# Altium project old_singleboard_now_mcu.PrjPcb (part 4 of 4)

## Sheet misc.SchDoc
size 381 x 241 mm; SheetNumber: 4; SheetTotal: 5
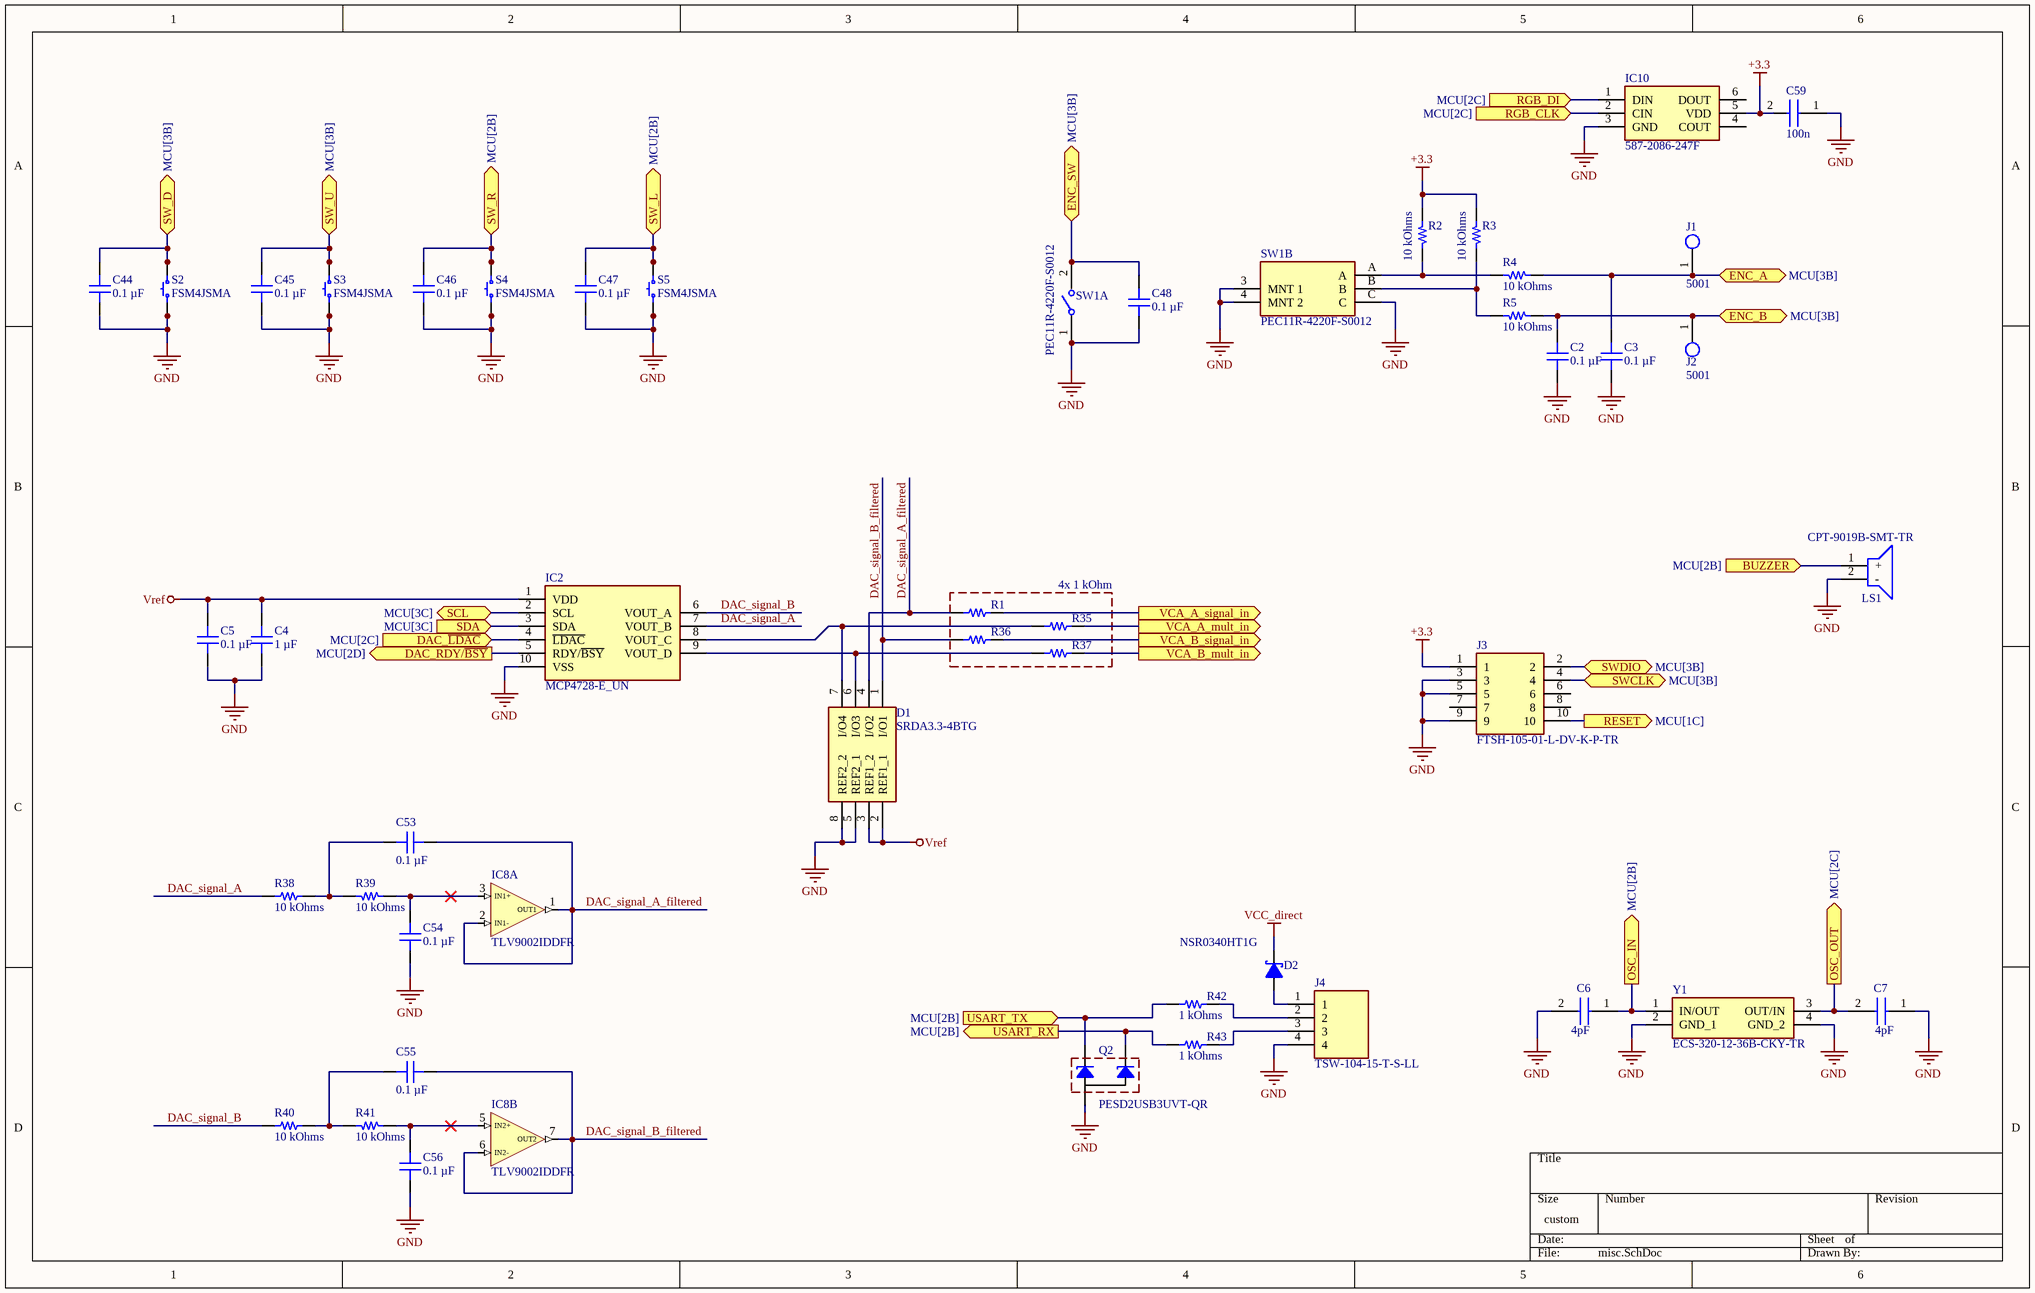
[diagram p8: misc.SchDoc]

### Parts
(Parts that share a designator on the sheet are numbered #1, #2 ... from top to bottom, then left to right.)
C2#2  0.1 µF  [CAP 1206_3216 - 0.8MM]
C3  0.1 µF  [CAP 1206_3216 - 0.8MM]
C4  1 µF  [CAP 1206_3216 - 0.8MM]
C5  0.1 µF  [CAP 1206_3216 - 0.8MM]
C6  4pF  [CAPC1608X80N]
C7#2  4pF  [CAPC1608X80N]
C44  0.1 µF  [CAP 1206_3216 - 0.8MM]
C45  0.1 µF  [CAP 1206_3216 - 0.8MM]
C46#2  0.1 µF  [CAP 1206_3216 - 0.8MM]
C47#2  0.1 µF  [CAP 1206_3216 - 0.8MM]
C48  0.1 µF  [CAP 1206_3216 - 0.8MM]
C53  0.1 µF  [CAP 1206_3216 - 0.8MM]
C54#2  0.1 µF  [CAP 1206_3216 - 0.8MM]
C55  0.1 µF  [CAP 1206_3216 - 0.8MM]
C56  0.1 µF  [CAP 1206_3216 - 0.8MM]
C59  100n  [C0805]
D1#2  SRDA3.3-4BTG  [SOIC8-127P600X175-8N]
D2#2  NSR0340HT1G  [SOD2512X110N]
IC2  MCP4728-E_UN  [SOP50P490X110-10N]
IC8  TLV9002IDDFR  [SOT65P280X110-8N]  (parts A,B of 3)
IC10  587-2086-247F  [5872086247F]
J1#1  5001  [FP-5001-MFG]
J2#1  5001  [FP-5001-MFG]
J3#2  FTSH-105-01-L-DV-K-P-TR  [FTSH-105-XX-YYY-DV-K-P-TR]
J4#2  TSW-104-15-T-S-LL  [HDRV4W64P254_1X4_1016X241X1575P]
LS1  CPT-9019B-SMT-TR  [CPT9019BSMTTR]
Q2#2  PESD2USB3UVT-QR  [SOT95P230X110-3N]
R1#2  1 kOhms  [YAGEO RES 1206_3216]  (value not drawn)
R2#2  10 kOhms  [YAGEO RES 1206_3216]
R3#2  10 kOhms  [YAGEO RES 1206_3216]
R4#2  10 kOhms  [YAGEO RES 1206_3216]
R5#2  10 kOhms  [YAGEO RES 1206_3216]
R35#2  1 kOhms  [YAGEO RES 1206_3216]  (value not drawn)
R36#2  1 kOhms  [YAGEO RES 1206_3216]  (value not drawn)
R37#2  1 kOhms  [YAGEO RES 1206_3216]  (value not drawn)
R38#2  10 kOhms  [RES 1206_3216]
R39#2  10 kOhms  [YAGEO RES 1206_3216]
R40#2  10 kOhms  [RES 1206_3216]
R41#2  10 kOhms  [YAGEO RES 1206_3216]
R42#2  1 kOhms  [YAGEO RES 1206_3216]
R43#2  1 kOhms  [YAGEO RES 1206_3216]
S2  FSM4JSMA  [TE FSM4JSMA]
S3  FSM4JSMA  [TE FSM4JSMA]
S4  FSM4JSMA  [TE FSM4JSMA]
S5  FSM4JSMA  [TE FSM4JSMA]
SW1  PEC11R-4220F-S0012  [FP-PEC11R-4220F-S0012-MFG]  (parts A,B of 2)
Y1  ECS-320-12-36B-CKY-TR  [ECS240836QAESTR]

### Blocks framed on the sheet
4x 1 kOhm: R1#2 R35#2 R36#2 R37#2

### Ports
BUZZER (in, see MCU[2B]), DAC_RDY/~{BSY} (out, see MCU[2D]), DAC_~{LDAC} (in, see MCU[2C]), ENC_A (bidir, see MCU[3B]), ENC_B (bidir, see MCU[3B]), ENC_SW (bidir, see MCU[3B]), OSC_IN (out, see MCU[2B]), OSC_OUT (out, see MCU[2C]), RESET (out, see MCU[1C]), RGB_CLK (in, see MCU[2C]), RGB_DI (in, see MCU[2C]), SCL (bidir, see MCU[3C]), SDA (in, see MCU[3C]), SW_D (bidir, see MCU[3B]), SW_L (bidir, see MCU[2B]), SW_R (bidir, see MCU[2B]), SW_U (bidir, see MCU[3B]), SWCLK (bidir, see MCU[3B]), SWDIO (bidir, see MCU[3B]), USART_RX (out, see MCU[2B]), USART_TX (in, see MCU[2B]), VCA_A_mult_in (out), VCA_A_signal_in (out), VCA_B_mult_in (out), VCA_B_signal_in (out)

### Nets
+3.3: C59.2 IC10.5(VDD) J3#2.1 R2#2.1 R3#2.1
GND: C2#2.1 C3.1 C4.1 C5.1 C6.2 C7#2.1 C44.1 C45.1 C46#2.1 C47#2.1 C48.1 C54#2.2 C56.2 C59.1 D1#2.5(REF2_1) D1#2.8(REF2_2) IC2.10(VSS) IC10.3(GND) J3#2.3 J3#2.5 J3#2.9 J4#2.4 LS1.2(-) Q2#2.3(CA) S2.1 S2.2 S3.1 S3.2 S4.1 S4.2 S5.1 S5.2 SW1.1 SW1.3(MNT_1) SW1.4(MNT_2) SW1.C Y1.2(GND_1) Y1.4(GND_2)
VCC_direct: D2#2.1(C)
Vref: C4.2 C5.2 D1#2.2(REF1_1) D1#2.3(REF1_2) IC2.1(VDD)
DAC_signal_A: IC2.7(VOUT_B) R38#2.1
DAC_signal_A_filtered: C53.1 D1#2.4(I/O2) IC8.1(OUT1) IC8.2(IN1-) R1#2.2
DAC_signal_B: IC2.6(VOUT_A) R40#2.1
DAC_signal_B_filtered: C55.1 D1#2.1(I/O1) IC8.6(IN2-) IC8.7(OUT2) R36#2.2
NetC1#2_2: J3#2.10 ; port RESET
NetC2#2_2: C2#2.2 J2#1.1 R5#2.2 ; port ENC_B
NetC3_2: C3.2 J1#1.1 R4#2.2 ; port ENC_A
NetC6_1: C6.1 Y1.1(IN/OUT) ; port OSC_IN
NetC7#2_2: C7#2.2 Y1.3(OUT/IN) ; port OSC_OUT
NetC44_2: C44.2 S2.3 S2.4 ; port SW_D
NetC45_2: C45.2 S3.3 S3.4 ; port SW_U
NetC46#2_2: C46#2.2 S4.3 S4.4 ; port SW_R
NetC47#2_2: C47#2.2 S5.3 S5.4 ; port SW_L
NetC48_2: C48.2 SW1.2 ; port ENC_SW
NetC53_2: C53.2 R38#2.2 R39#2.2
NetC54#2_1: C54#2.1 IC8.3(IN1+) R39#2.1
NetC55_2: C55.2 R40#2.2 R41#2.2
NetC56_1: C56.1 IC8.5(IN2+) R41#2.1
NetD1#2_6: D1#2.6(I/O3) IC2.9(VOUT_D) R37#2.2
NetD1#2_7: D1#2.7(I/O4) IC2.8(VOUT_C) R35#2.2
NetD2#2_2: D2#2.2(A) J4#2.1
NetIC1_1: LS1.1(+) ; port BUZZER
NetIC1_11: IC10.1(DIN) ; port RGB_DI
NetIC1_12: IC10.2(CIN) ; port RGB_CLK
NetIC1_13: IC2.4(~{LDAC}) ; port DAC_~{LDAC}
NetIC1_14: IC2.5(RDY/~{BSY}) ; port DAC_RDY/~{BSY}
NetIC1_25: IC2.2(SCL) ; port SCL
NetIC1_26: IC2.3(SDA) ; port SDA
NetIC1_35: J3#2.2 ; port SWDIO
NetIC1_36: J3#2.4 ; port SWCLK
NetIC1_45: Q2#2.1(K1) R42#2.2 ; port USART_TX
NetIC1_46: Q2#2.2(K2) R43#2.2 ; port USART_RX
NetJ4#2_2: J4#2.2 R42#2.1
NetJ4#2_3: J4#2.3 R43#2.1
NetR1#2_1: R1#2.1 ; port VCA_A_signal_in
NetR2#2_2: R2#2.2 R4#2.1 SW1.A
NetR3#2_2: R3#2.2 R5#2.1 SW1.B
NetR27#1_1: R35#2.1 ; port VCA_A_mult_in
NetR36#2_1: R36#2.1 ; port VCA_B_signal_in
NetR37#2_1: R37#2.1 ; port VCA_B_mult_in

Not connected (* = marked no-connect by the designer): IC10 4(COUT) 6(DOUT); J3#2 6 7 8

### Library data of the parts
C2#2 C3 C5 C44 C45 C46#2 C47#2 C48 C53 C54#2 C55 C56 = 885012208087: CAP CER 0.1UF 50V X7R 1206; manufacturer: Würth Elektronik; Tolerance: ±10%; Part Number: 885012208087; Capacitance: 0.1 µF; Applications: General Purpose; componentlink1description: Datasheet; componentlink1url: https://katalog.we-online.de/pbs/datasheet/885012208087.pdf; componentlink2description: DigiKey Link; componentlink2url: https://www.digikey.com/en/products/detail/würth-elektronik/885012208087/5453982; Device Package: 1206 (3216 Metric); lastupdated: 6/4/2024 19:10:27; Lifecycle Status: Active; Minimum Order: 1; Mounting Type: Surface Mount, MLCC; Operating Temperature: -55°C ~ 125°C; Package / Case: 1206 (3216 Metric); packaging: TapeAndReel; partid: 20879; Part Status: Active; price: 0.06; series: WCAP-CSGP; Size / Dimension: 0.126" L x 0.063" W (3.20mm x 1.60mm); Supplier 1: DigiKey; Supplier Part Number 1: 732-8127-1-ND; Temperature Coefficient: X7R; Thickness (Max): 0.035" (0.90mm); value: 0.1 µF; Voltage - Rated: 50V
C4 = 885012208093: as C7#1 on sheet vca_A; Part Number: 885012208093; Capacitance: 1 µF; Applications: General Purpose; componentlink1description: Datasheet; componentlink1url: https://katalog.we-online.de/pbs/datasheet/885012208093.pdf; componentlink2description: DigiKey Link; componentlink2url: https://www.digikey.com/en/products/detail/würth-elektronik/885012208093/5453432; Device Package: 1206 (3216 Metric); lastupdated: 6/4/2024 19:10:33; Lifecycle Status: Active; Minimum Order: 1; Mounting Type: Surface Mount, MLCC; Operating Temperature: -55°C ~ 125°C; Package / Case: 1206 (3216 Metric); packaging: TapeAndReel; partid: 39665; Part Status: Active; price: 0.10; series: WCAP-CSGP; Size / Dimension: 0.126" L x 0.063" W (3.20mm x 1.60mm); Supplier 1: DigiKey; Supplier Part Number 1: 732-7577-1-ND; Temperature Coefficient: X7R; Thickness (Max): 0.075" (1.90mm); value: 1 µF; Voltage - Rated: 50V
C6 C7#2 = C1608C0G1H040C080AA: Capacitor; Manufacturer_Name: TDK; Datasheet Link: https://product.tdk.com/info/en/catalog/datasheets/mlcc_commercial_midvoltage_en.pdf; Height: 0.8mm; Manufacturer_Part_Number: C1608C0G1H040C080AA; Arrow Part Number: C1608C0G1H040C080AA; Arrow Price/Stock: https://www.arrow.com/en/products/c1608c0g1h040c080aa/tdk
C59 = C0805C104K3RACTU: Capacitor; Manufacturer_Name: KEMET; Datasheet Link: https://content.kemet.com/datasheets/KEM_C1002_X7R_SMD.pdf; Height: 1.1mm; Manufacturer_Part_Number: C0805C104K3RACTU; Mouser Part Number: 80-C0805C104K3R; Mouser Price/Stock: https://www.mouser.co.uk/ProductDetail/KEMET/C0805C104K3RACTU?qs=zZwvocWqSRjmUvfNxkIN%2Fg%3D%3D; Arrow Part Number: C0805C104K3RACTU; Arrow Price/Stock: https://www.arrow.com/en/products/c0805c104k3ractu/kemet-corporation
D1#2 = SRDA3.3-4BTG: TVS Diode (Bi-directional); Manufacturer_Name: LITTELFUSE; Datasheet Link: https://www.littelfuse.com/~/media/electronics/datasheets/tvs_diode_arrays/littelfuse_tvs_diode_array_srda3_3_datasheet.pdf.pdf; Height: 1.75mm; Manufacturer_Part_Number: SRDA3.3-4BTG; Mouser Part Number: 576-SRDA3.3-4BTG; Mouser Price/Stock: https://www.mouser.co.uk/ProductDetail/Littelfuse/SRDA3.3-4BTG?qs=wqPJ3MBjhrh9DaqZL3Nnvw%3D%3D; Arrow Part Number: SRDA3.3-4BTG; Arrow Price/Stock: https://www.arrow.com/en/products/srda3.3-4btg/littelfuse?utm_currency=USD&region=nac
D2#2 = NSR0340HT1G: Diode; Manufacturer_Name: onsemi; Datasheet Link: https://www.onsemi.com/pub/Collateral/NSR0340H-D.PDF; Height: 1.1mm; Manufacturer_Part_Number: NSR0340HT1G; Mouser Part Number: 863-NSR0340HT1G; Mouser Price/Stock: https://www.mouser.co.uk/ProductDetail/onsemi/NSR0340HT1G?qs=agb4oTp1Mj%2FMC6G4Sgc%2FTQ%3D%3D; Arrow Part Number: NSR0340HT1G; Arrow Price/Stock: https://www.arrow.com/en/products/nsr0340ht1g/on-semiconductor?utm_currency=USD&region=nac
IC2 = MCP4728-E_UN: Integrated Circuit; Manufacturer_Name: Microchip; Manufacturer_Part_Number: MCP4728-E/UN; Datasheet Link: http://ww1.microchip.com/downloads/en/DeviceDoc/22187E.pdf; Height: 1.1mm; Mouser Part Number: 579-MCP4728-E/UN; Mouser Price/Stock: https://www.mouser.co.uk/ProductDetail/Microchip-Technology/MCP4728-E-UN?qs=E6wAi2XWqcP2zTenScklGA%3D%3D; Arrow Part Number: MCP4728-E/UN; Arrow Price/Stock: https://www.arrow.com/en/products/mcp4728-eun/microchip-technology?utm_currency=USD&region=nac
IC8 = TLV9002IDDFR: as IC3 on sheet filters; Datasheet Link: https://www.ti.com/lit/gpn/TLV9002; Height: 1.1mm; Manufacturer_Part_Number: TLV9002IDDFR; Mouser Part Number: 595-TLV9002IDDFR; Mouser Price/Stock: https://www.mouser.co.uk/ProductDetail/Texas-Instruments/TLV9002IDDFR?qs=mAH9sUMRCtuVJ6NmNV%252Bgrw%3D%3D; Arrow Part Number: TLV9002IDDFR; Arrow Price/Stock: https://www.arrow.com/en/products/tlv9002iddfr/texas-instruments?utm_currency=USD&region=nac
IC10 = 587-2086-247F: Integrated Circuit; Manufacturer_Name: Dialight; Datasheet Link: https://s3-us-west-2.amazonaws.com/catsy.557/Dialight_datasheet_587-2086-247F_Addressable_RGB.pdf; Height: 1mm; Manufacturer_Part_Number: 587-2086-247F; Mouser Part Number: 645-587-2086-247F; Mouser Price/Stock: https://www.mouser.co.uk/ProductDetail/Dialight/587-2086-247F?qs=iLKYxzqNS76TDIp9wEi56Q%3D%3D
J1#1 J2#1 = CMP-2000-05181-2: PC TEST POINT MINIATURE BLACK; Body Material: Bronze; Plating: Silver; Inside Diameter: 1.27mm; Hole Diameter: 1.6mm; Number of Ports: 1; Outside Diameter: 2.54mm; Insulation: Insulated; Insulation Material: Nylon; Mount: Through Hole; RoHS Compliant: Yes; Series: THM; Height: 0.3inch; Termination: Through Hole; Material: Nylon; Packaging: Bulk; Contact Material: Bronze; REACH SVHC: No SVHC; Contact Plating: Silver; Orientation: Straight; Lead Free: Lead Free; Package Quantity: 100; Length: 7.62mm; Flammability Rating: UL94 V-0; Number of Contacts: 1; Diameter: 2.54mm; Housing Color: Black; Color: Black
J3#2 = FTSH-105-01-L-DV-K-P-TR: Connector; Manufacturer_Name: SAMTEC; Datasheet Link: http://suddendocs.samtec.com/prints/ftsh-1xx-xx-xxx-dv-xxx-xxx-mkt.pdf; Manufacturer_Part_Number: FTSH-105-01-L-DV-K-P-TR; Mouser Part Number: 200-FTSH10501LDVKPTR; Mouser Price/Stock: https://www.mouser.co.uk/ProductDetail/Samtec/FTSH-105-01-L-DV-K-P-TR?qs=fnpEE5GccuMUjCRgxv4voQ%3D%3D; Arrow Part Number: FTSH-105-01-L-DV-K-P-TR; Arrow Price/Stock: https://www.arrow.com/en/products/ftsh-105-01-l-dv-k-p-tr/samtec?utm_currency=USD&region=europe
J4#2 = TSW-104-15-T-S-LL: Connector; Manufacturer_Name: SAMTEC; Datasheet Link: http://suddendocs.samtec.com/catalog_english/tsw_th.pdf; Height: 15.75mm; Manufacturer_Part_Number: TSW-104-15-T-S-LL; Mouser Part Number: 200-TSW10415TSLL; Mouser Price/Stock: https://www.mouser.co.uk/ProductDetail/Samtec/TSW-104-15-T-S-LL?qs=rU5fayqh%252BE1Oq%252BEC9ZwiVQ%3D%3D
LS1 = CPT-9019B-SMT-TR: Loudspeaker or Buzzer; Manufacturer_Name: Same Sky; Datasheet Link: https://www.sameskydevices.com/product/resource/supplyframepdf/cpt-9019b-smt-tr.pdf; Height: 2.1mm; Manufacturer_Part_Number: CPT-9019B-SMT-TR; Mouser Part Number: 179-CPT-9019B-SMT-TR; Mouser Price/Stock: https://www.mouser.co.uk/ProductDetail/CUI-Devices/CPT-9019B-SMT-TR?qs=3Rah4i%252BhyCGQOzp5C27TLw%3D%3D
Q2#2 = PESD2USB3UVT-QR: Transistor; Manufacturer_Name: Nexperia; Datasheet Link: https://assets.nexperia.com/documents/data-sheet/PESD2USB3UVT-Q.pdf; Height: 1.1mm; Manufacturer_Part_Number: PESD2USB3UVT-QR; Mouser Part Number: 771-PESD2USB3UVT-QR; Mouser Price/Stock: https://www.mouser.co.uk/ProductDetail/Nexperia/PESD2USB3UVT-QR?qs=3Rah4i%252BhyCFPJOQFghMZ%252BQ%3D%3D; Arrow Part Number: PESD2USB3UVT-QR; Arrow Price/Stock: https://www.arrow.com/en/products/pesd2usb3uvt-qr/nexperia?utm_currency=USD&region=europe
R1#2 R35#2 R36#2 R37#2 R42#2 R43#2 = RT1206FRE071KL: RES SMD 1K OHM 1% 1/4W 1206; Manufacturer: Yageo; Power (Watts): 0.25W, 1/4W; Temperature Coefficient: ±50ppm/°C; Part Number: RT1206FRE071KL; ComponentLink1Description: Datasheet; ComponentLink1URL: https://www.yageo.com/upload/media/product/productsearch/datasheet/rchip/PYu-RT_1-to-0.01_RoHS_L_11.pdf; ComponentLink2Description: DigiKey Link; ComponentLink2URL: https://www.digikey.com/en/products/detail/yageo/RT1206FRE071KL/1083016; Composition: Thin Film; Device Package: 1206 (3216 Metric); Height - Seated (Max): 0.026" (0.65mm); LastUpdated: 7/25/2024 09:21:27; Lifecycle Status: Active; Minimum Order: 1; Number of Terminations: 2; Operating Temperature: -55°C ~ 155°C; Package / Case: 1206 (3216 Metric); Packaging: TapeAndReel; PartId: 40465; Part Status: Active; Price: 0.01; Resistance: 1 kOhms; Series: RT; Size / Dimension: 0.122" L x 0.063" W (3.10mm x 1.60mm); Supplier 1: DigiKey; Supplier Part Number 1: YAG3366CT-ND; Supplier Device Package: 1206; Tolerance: ±1%; Value: 1 kOhms
R2#2 R3#2 R4#2 R5#2 R39#2 R41#2 = RT1206FRE0710KL: as R60 on sheet source_A; Part Number: RT1206FRE0710KL; ComponentLink1Description: Datasheet; ComponentLink1URL: https://www.yageo.com/upload/media/product/productsearch/datasheet/rchip/PYu-RT_1-to-0.01_RoHS_L_11.pdf; ComponentLink2Description: DigiKey Link; ComponentLink2URL: https://www.digikey.com/en/products/detail/yageo/RT1206FRE0710KL/1082868; Composition: Thin Film; Device Package: 1206 (3216 Metric); Height - Seated (Max): 0.026" (0.65mm); LastUpdated: 7/25/2024 09:21:28; Lifecycle Status: Active; Minimum Order: 1; Number of Terminations: 2; Operating Temperature: -55°C ~ 155°C; Package / Case: 1206 (3216 Metric); Packaging: TapeAndReel; PartId: 38903; Part Status: Active; Price: 0.01; Resistance: 10 kOhms; Series: RT; Size / Dimension: 0.122" L x 0.063" W (3.10mm x 1.60mm); Supplier 1: DigiKey; Supplier Part Number 1: YAG1242CT-ND; Supplier Device Package: 1206; Tolerance: ±1%; Value: 10 kOhms
R38#2 R40#2 = ERA-8AEB103V: RES SMD 10K OHM 0.1% 1/4W 1206; Manufacturer: Panasonic Electronic Components; Power (Watts): 0.25W, 1/4W; Temperature Coefficient: ±25ppm/°C; Part Number: ERA-8AEB103V; ComponentLink1Description: Datasheet; ComponentLink1URL: https://industrial.panasonic.com/cdbs/www-data/pdf/RDM0000/AOA0000C307.pdf; ComponentLink2Description: DigiKey Link; ComponentLink2URL: https://www.digikey.com/en/products/detail/panasonic-electronic-components/ERA-8AEB103V/3070742; Composition: Thin Film; Device Package: 1206 (3216 Metric); Features: Automotive AEC-Q200; Height - Seated (Max): 0.028" (0.70mm); LastUpdated: 2/9/2024 20:54:17; Lifecycle Status: Active; Minimum Order: 1; Number of Terminations: 2; Operating Temperature: -55°C ~ 155°C; Package / Case: 1206 (3216 Metric); Packaging: TapeAndReel; PartId: 33990; Part Status: Active; Price: 0.10; Ratings: AEC-Q200; Resistance: 10 kOhms; Series: ERA-8A; Size / Dimension: 0.126" L x 0.063" W (3.20mm x 1.60mm); Supplier 1: DigiKey; Supplier Part Number 1: P10KBCCT-ND; Supplier Device Package: 1206; Tolerance: ±0.1%; Value: 10 kOhms
S2-S5 = FSM4JSMA: SWITCH TACTILE SPST-NO 0.05A 24V; Manufacturer: TE Connectivity ALCOSWITCH Switches; Actuator Height off PCB, Vertical: 5.00mm; Actuator Orientation: Top Actuated; Actuator Type: Standard; Contact Rating @ Voltage: 0.05A @ 24VDC; Illumination: Non-Illuminated; Operating Force: 160gf; Outline: 6.00mm x 6.00mm; Switch Function: Off-Mom; Part Number: FSM4JSMA; Circuit: SPST-NO; ComponentLink1Description: Datasheet; ComponentLink1URL: https://www.te.com/commerce/DocumentDelivery/DDEController?Action=srchrtrv&DocNm=1308111-1_SWITCHES_CORE_PROGRAM_CATALOG&DocType=CS&DocLang=English; ComponentLink2Description: DigiKey Link; ComponentLink2URL: https://www.digikey.com/en/products/detail/te-connectivity-alcoswitch-switches/FSM4JSMA/525821; LastUpdated: 6/3/2024 20:19:31; Lifecycle Status: Active; Minimum Order: 1; Mounting Type: Surface Mount; Operating Temperature: -35°C ~ 85°C; Packaging: Bulk; Part Status: Active; Price: 0.14; Series: FSMJSMA; Supplier 1: DigiKey; Supplier Part Number 1: 450-1129-ND; Termination Style: Gull Wing
SW1 = PEC11R-4220F-S0012: ROTARY ENCODER MECHANICAL 12PPR; Built in Switch: Yes; Number of Channels: 2; Output Type: Quadrature; Hole Diameter: 7mm; Pulses per Revolution: 12; Termination: PC Pin; Package Quantity: 150; RoHS Compliant: Yes; Mount: Through Hole; Width: 12.5mm; Radiation Hardening: No; Number of Pins: 5; REACH SVHC: No SVHC; Type: Mechanical; Packaging: Bulk; Min Operating Temperature: -30°C; Encoder Type: Mechanical; Height: 13.4mm; Length: 26.5mm; Orientation: Vertical; Max Operating Temperature: 70°C; Series: PEC11R; Detent: Yes
Y1 = ECS-320-12-36B-CKY-TR: Crystal or Oscillator; Manufacturer_Name: ECS; Datasheet Link: https://www.ecsxtal.com/store/pdf/ECX-2236B.pdf; Height: 0mm; Manufacturer_Part_Number: ECS-320-12-36B-CKY-TR; Mouser Part Number: 520-320-12-36B-CKYT; Mouser Price/Stock: https://www.mouser.co.uk/ProductDetail/ECS/ECS-320-12-36B-CKY-TR?qs=l7cgNqFNU1juKISosFzRbg%3D%3D; Arrow Part Number: ECS-320-12-36B-CKY-TR; Arrow Price/Stock: https://www.arrow.com/en/products/ecs-320-12-36b-cky-tr/ecs-international

## Sheet connectors.SchDoc
size 381 x 241 mm; SheetNumber: 10; SheetTotal: 12
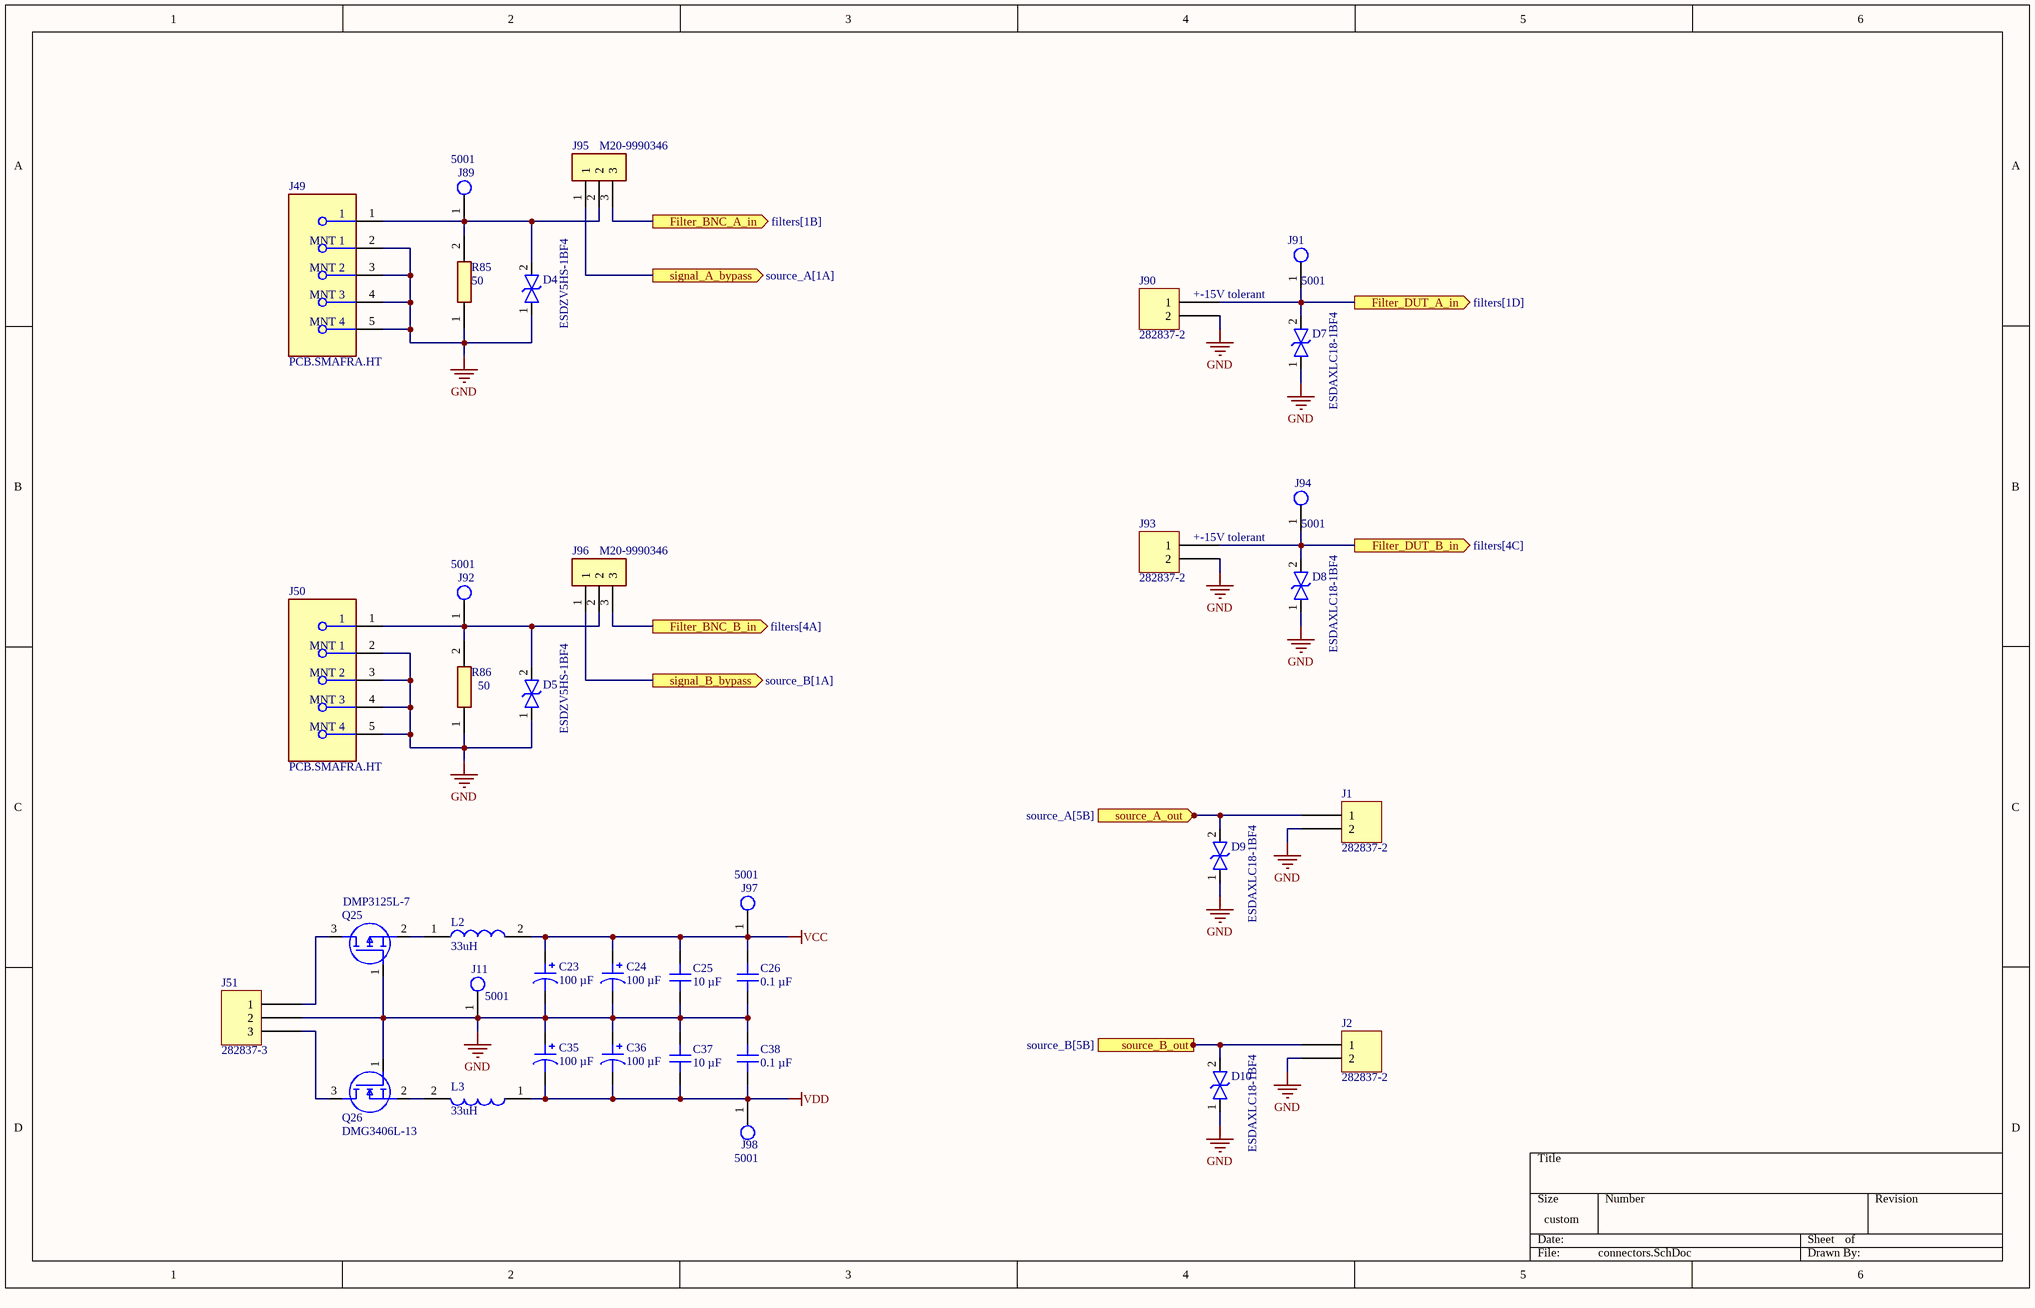
[diagram p9: connectors.SchDoc]

### Parts
(Parts that share a designator on the sheet are numbered #1, #2 ... from top to bottom, then left to right.)
C23#1  100 µF  [CAP ALSMD 8.3MM H10.5MM]
C24#1  100 µF  [CAP ALSMD 8.3MM H10.5MM]
C25#2  10 µF  [CAP 1206_3216 - 0.8MM]
C26#2  0.1 µF  [CAP 1206_3216 - 0.8MM]
C35#2  100 µF  [CAP ALSMD 8.3MM H10.5MM]
C36#2  100 µF  [CAP ALSMD 8.3MM H10.5MM]
C37#2  10 µF  [CAP 1206_3216 - 0.8MM]
C38#2  0.1 µF  [CAP 1206_3216 - 0.8MM]
D4#2  ESDZV5HS-1BF4  [ESDZV5HS1BF4]
D5#2  ESDZV5HS-1BF4  [ESDZV5HS1BF4]
D7#2  ESDAXLC18-1BF4  [ESDAXLC181BF4]
D8#2  ESDAXLC18-1BF4  [ESDAXLC181BF4]
D9  ESDAXLC18-1BF4  [ESDAXLC181BF4]
D10  ESDAXLC18-1BF4  [ESDAXLC181BF4]
J1#2  282837-2  [TE 282837-2]
J2#2  282837-2  [TE 282837-2]
J11  5001  [FP-5001-MFG]
J49  PCB.SMAFRA.HT  [FP-PCB_SMAFRA_HT-MFG]
J50  PCB.SMAFRA.HT  [FP-PCB_SMAFRA_HT-MFG]
J51  282837-3  [TE 282837-3]
J89  5001  [FP-5001-MFG]
J90  282837-2  [TE 282837-2]
J91  5001  [FP-5001-MFG]
J92  5001  [FP-5001-MFG]
J93  282837-2  [TE 282837-2]
J94  5001  [FP-5001-MFG]
J95  M20-9990346  [HDRV3W64P0X254_1X3_762X254X864P]
J96  M20-9990346  [HDRV3W64P0X254_1X3_762X254X864P]
J97  5001  [FP-5001-MFG]
J98  5001  [FP-5001-MFG]
L2  33uH  [INDPM116102X400N]
L3  33uH  [INDPM116102X400N]
Q25  DMP3125L-7  [SOT96P240X110-3N]
Q26  DMG3406L-13  [SOT96P240X110-3N]
R85  50  [RESC6332X65N]
R86  50  [RESC6332X65N]

### Ports
Filter_BNC_A_in (out, see filters[1B]), Filter_BNC_B_in (out, see filters[4A]), Filter_DUT_A_in (out, see filters[1D]), Filter_DUT_B_in (out, see filters[4C]), signal_A_bypass (out, see source_A[1A]), signal_B_bypass (out, see source_B[1A]), source_A_out (in, see source_A[5B]), source_B_out (in, see source_B[5B])

### Nets
GND: C23#1.2 C24#1.2 C25#2.1 C26#2.1 C35#2.1 C36#2.1 C37#2.2 C38#2.2 D4#2.1 D5#2.1 D7#2.1 D8#2.1 D9.1 D10.1 J1#2.2 J2#2.2 J11.1 J49.2(MNT_1) J49.3(MNT_2) J49.4(MNT_3) J49.5(MNT_4) J50.2(MNT_1) J50.3(MNT_2) J50.4(MNT_3) J50.5(MNT_4) J51.2 J90.2 J93.2 Q25.1(G) Q26.1(G) R85.1 R86.1
VCC: C23#1.1 C24#1.1 C25#2.2 C26#2.2 J97.1 L2.2
VDD: C35#2.2 C36#2.2 C37#2.1 C38#2.1 J98.1 L3.1
NetD3#1_2: J96.3 ; port Filter_BNC_B_in
NetD4#1_2: J95.3 ; port Filter_BNC_A_in
NetD4#2_2: D4#2.2 J49.1 J89.1 J95.2 R85.2
NetD5#2_2: D5#2.2 J50.1 J92.1 J96.2 R86.2
NetD7#1_2: D8#2.2 J93.1 J94.1 ; port Filter_DUT_B_in
NetD7#2_2: D7#2.2 J90.1 J91.1 ; port Filter_DUT_A_in
NetD9_2: D9.2 J1#2.1 ; port source_A_out
NetD10_2: D10.2 J2#2.1 ; port source_B_out
NetJ51_1: J51.1 Q25.3(D)
NetJ51_3: J51.3 Q26.3(D)
NetJ95_1: J95.1 ; port signal_A_bypass
NetJ96_1: J96.1 ; port signal_B_bypass
NetL2_1: L2.1 Q25.2(S)
NetL3_2: L3.2 Q26.2(S)

### Notes on the sheet
- (near J90) +-15V tolerant
- (near J93) +-15V tolerant

### Library data of the parts
C23#1 C24#1 C35#2 C36#2 = 50TZV100M8X10.5: CAP ALUM 100UF 20% 50V SMD; manufacturer: Rubycon; Impedance: 340 mOhms; Lifetime @ Temp.: 2000 Hrs @ 105°C; Polarization: Polar; Ripple Current @ High Frequency: 350 mA @ 100 kHz; Ripple Current @ Low Frequency: 175 mA @ 120 Hz; Surface Mount Land Size: 0.327" L x 0.327" W (8.30mm x 8.30mm); Part Number: 50TZV100M8X10.5; Applications: Automotive; Capacitance: 100 µF; componentlink1description: Datasheet; componentlink1url: http://www.rubycon.co.jp/en/catalog/e_pdfs/aluminum/e_tzv.pdf; componentlink2description: DigiKey Link; componentlink2url: https://www.digikey.com/en/products/detail/rubycon/50TZV100M8X10-5/3134931; Device Package: Radial, Can - SMD; Height - Seated (Max): 0.413" (10.50mm); lastupdated: 6/3/2024 20:15:48; Lifecycle Status: Active; Minimum Order: 1; Mounting Type: Surface Mount; Operating Temperature: -55°C ~ 105°C; Package / Case: Radial, Can - SMD; packaging: TapeAndReel; partid: 7533; Part Status: Active; price: 0.16; Ratings: AEC-Q200; series: TZV; Size / Dimension: 0.315" Dia (8.00mm); Supplier 1: DigiKey; Supplier Part Number 1: 1189-1651-1-ND; Tolerance: ±20%; value: 100 µF; Voltage - Rated: 50 V
C25#2 C37#2 = 885012208069: CAP CER 10UF 25V X7R 1206; manufacturer: Würth Elektronik; Tolerance: ±10%; Part Number: 885012208069; Capacitance: 10 µF; Applications: General Purpose; componentlink1description: Datasheet; componentlink1url: https://katalog.we-online.de/pbs/datasheet/885012208069.pdf; componentlink2description: DigiKey Link; componentlink2url: https://www.digikey.com/en/products/detail/würth-elektronik/885012208069/5453429; Device Package: 1206 (3216 Metric); lastupdated: 6/4/2024 19:10:32; Lifecycle Status: Active; Minimum Order: 1; Mounting Type: Surface Mount, MLCC; Operating Temperature: -55°C ~ 125°C; Package / Case: 1206 (3216 Metric); packaging: TapeAndReel; partid: 43199; Part Status: Active; price: 0.40; series: WCAP-CSGP; Size / Dimension: 0.126" L x 0.063" W (3.20mm x 1.60mm); Supplier 1: DigiKey; Supplier Part Number 1: 732-7574-1-ND; Temperature Coefficient: X7R; Thickness (Max): 0.075" (1.90mm); value: 10 µF; Voltage - Rated: 25V
C26#2 C38#2 = 885012208087: as C2#2 on sheet misc; Part Number: 885012208087; Capacitance: 0.1 µF; Applications: General Purpose; componentlink1description: Datasheet; componentlink1url: https://katalog.we-online.de/pbs/datasheet/885012208087.pdf; componentlink2description: DigiKey Link; componentlink2url: https://www.digikey.com/en/products/detail/würth-elektronik/885012208087/5453982; Device Package: 1206 (3216 Metric); lastupdated: 6/4/2024 19:10:27; Lifecycle Status: Active; Minimum Order: 1; Mounting Type: Surface Mount, MLCC; Operating Temperature: -55°C ~ 125°C; Package / Case: 1206 (3216 Metric); packaging: TapeAndReel; partid: 20879; Part Status: Active; price: 0.06; series: WCAP-CSGP; Size / Dimension: 0.126" L x 0.063" W (3.20mm x 1.60mm); Supplier 1: DigiKey; Supplier Part Number 1: 732-8127-1-ND; Temperature Coefficient: X7R; Thickness (Max): 0.035" (0.90mm); value: 0.1 µF; Voltage - Rated: 50V
D4#2 D5#2 = ESDZV5HS-1BF4: TVS Diode (Bi-directional); Manufacturer_Name: STMicroelectronics; Datasheet Link: https://www.st.com/resource/en/datasheet/esdzv5hs-1bf4.pdf; Height: 0.33mm; Manufacturer_Part_Number: ESDZV5HS-1BF4; Mouser Part Number: 511-ESDZV5HS-1BF4; Mouser Price/Stock: https://www.mouser.co.uk/ProductDetail/STMicroelectronics/ESDZV5HS-1BF4?qs=l7cgNqFNU1hPMpLiUWAylw%3D%3D; Arrow Part Number: ESDZV5HS-1BF4; Arrow Price/Stock: https://www.arrow.com/en/products/esdzv5hs-1bf4/stmicroelectronics?region=nac
D7#2 D8#2 D9 D10 = ESDAXLC18-1BF4: TVS Diode (Bi-directional); Manufacturer_Name: STMicroelectronics; Datasheet Link: https://www.st.com/resource/en/datasheet/esdaxlc18-1bf4.pdf; Height: 0.32mm; Manufacturer_Part_Number: ESDAXLC18-1BF4; Mouser Part Number: 511-ESDAXLC18-1BF4; Mouser Price/Stock: https://www.mouser.co.uk/ProductDetail/STMicroelectronics/ESDAXLC18-1BF4?qs=Mv7BduZupUgBxpJyOqfYsQ%3D%3D; Arrow Part Number: ESDAXLC18-1BF4; Arrow Price/Stock: https://www.arrow.com/en/products/esdaxlc18-1bf4/stmicroelectronics
J1#2 J2#2 J90 J93 = 282837-2: TERM BLK 2P SIDE ENT 5.08MM PCB; Manufacturer: TE Connectivity AMP Connectors; Current: 13.5 A; Mating Orientation: Horizontal with Board; Number of Levels: 1; Pitch: 0.200" (5.08mm); Positions Per Level: 2; Voltage: 300 V; Wire Gauge: 16-28 AWG; Wire Termination: Screw - Rising Cage Clamp; Part Number: 282837-2; Color: Green; ComponentLink1Description: Datasheet; ComponentLink1URL: https://www.te.com/commerce/DocumentDelivery/DDEController?Action=srchrtrv&DocNm=282837&DocType=Customer+Drawing&DocLang=English; ComponentLink2Description: DigiKey Link; ComponentLink2URL: https://www.digikey.com/en/products/detail/te-connectivity-amp-connectors/282837-2/2187973; Features: Interlocking (Side); LastUpdated: 6/21/2022 15:00:23; Lifecycle Status: Active; Minimum Order: 1; Mounting Type: Through Hole; Packaging: Tray; Part Status: Active; Price: 0.31; Series: Buchanan; Supplier 1: DigiKey; Supplier Part Number 1: A113320-ND
J11 J89 J91 J92 J94 J97 J98 = CMP-2000-05181-2: as J1#1 on sheet misc; Insulation Material: Nylon; Mount: Through Hole; RoHS Compliant: Yes; Series: THM; Height: 0.3inch; Termination: Through Hole; Material: Nylon; Packaging: Bulk; Contact Material: Bronze; REACH SVHC: No SVHC; Contact Plating: Silver; Orientation: Straight; Lead Free: Lead Free; Package Quantity: 100; Length: 7.62mm; Flammability Rating: UL94 V-0; Number of Contacts: 1; Diameter: 2.54mm; Housing Color: Black; Color: Black
J49 J50 = CMP-111093-000003-1: CONN SMA JACK R/A 50OHM PCB; Dielectric Material: PTFE; Max Frequency: 6GHz; Body Material: Brass; Center Contact Plating: Gold; Voltage Rating: 500V; Operating Frequency: 0 to 6 GHz; Number of Ports: 1; Impedance: 50R; Housing Color: Gold; Mount: Through Hole; Orientation: Right Angle; Termination: Solder; Contact Material: Brass; Series: -; Contact Plating: Gold; Fastening Type: Threaded; Connector Type: SMA; Package Quantity: 500; Case/Package: SMA; Body Plating: Gold; Frequency: 6GHz; Packaging: Tray
J51 = 282837-3: TERM BLK 3P SIDE ENT 5.08MM PCB; Manufacturer: TE Connectivity AMP Connectors; Current: 13.5 A; Mating Orientation: Horizontal with Board; Number of Levels: 1; Pitch: 0.200" (5.08mm); Positions Per Level: 3; Voltage: 300 V; Wire Gauge: 16-28 AWG; Wire Termination: Screw - Rising Cage Clamp; Part Number: 282837-3; Color: Green; ComponentLink1Description: Datasheet; ComponentLink1URL: https://www.te.com/commerce/DocumentDelivery/DDEController?Action=srchrtrv&DocNm=282837&DocType=Customer+Drawing&DocLang=English; ComponentLink2Description: DigiKey Link; ComponentLink2URL: https://www.digikey.com/en/products/detail/te-connectivity-amp-connectors/282837-3/2187974; Features: Interlocking (Side); LastUpdated: 6/21/2022 15:00:39; Lifecycle Status: Active; Minimum Order: 1; Mounting Type: Through Hole; Packaging: Tray; Part Status: Active; Price: 0.47; Series: Buchanan; Supplier 1: DigiKey; Supplier Part Number 1: A113321-ND
J95 J96 = M20-9990346: Connector; Manufacturer_Name: Harwin; Datasheet Link: https://cdn.harwin.com/pdfs/M20-999.pdf; Height: 8.64mm; Manufacturer_Part_Number: M20-9990346; Mouser Part Number: 855-M20-9990346; Mouser Price/Stock: https://www.mouser.co.uk/ProductDetail/Harwin/M20-9990346?qs=ulE8k0yEMYbyhQ3uXpFs8Q%3D%3D
L2 L3 = AMRM00101040330MA1: Inductor; Manufacturer_Name: Pulse Electronics; Datasheet Link: https://productfinder.pulseelectronics.com/api/open/part-attachments/datasheet/amrm00101040330ma1; Height: 4mm; Manufacturer_Part_Number: AMRM00101040330MA1; Mouser Part Number: 673-AMRM101040330MA1; Mouser Price/Stock: https://www.mouser.co.uk/ProductDetail/Pulse-Electronics/AMRM00101040330MA1?qs=HoCaDK9Nz5eI6M5ad0CXDA%3D%3D; Value: 33uH
Q25 = DMP3125L-7: MOSFET (P-Channel); Manufacturer_Name: Diodes Incorporated; Datasheet Link: https://www.diodes.com//assets/Datasheets/DMP3125L.pdf; Height: 1.1mm; Manufacturer_Part_Number: DMP3125L-7; Mouser Part Number: 621-DMP3125L-7; Mouser Price/Stock: https://www.mouser.co.uk/ProductDetail/Diodes-Incorporated/DMP3125L-7?qs=W0yvOO0ixfH8ma8MdHfXQA%3D%3D; Arrow Part Number: DMP3125L-7; Arrow Price/Stock: https://www.arrow.com/en/products/dmp3125l-7/diodes-incorporated?region=nac
Q26 = DMG3406L-13: MOSFET (N-Channel); Manufacturer_Name: Diodes Incorporated; Datasheet Link: https://www.diodes.com//assets/Datasheets/DMG3406L.pdf; Height: 1.1mm; Manufacturer_Part_Number: DMG3406L-13; Mouser Part Number: 621-DMG3406L-13; Mouser Price/Stock: https://www.mouser.co.uk/ProductDetail/Diodes-Incorporated/DMG3406L-13?qs=BvpHGKeVh3r%252BRZTTCOfjpg%3D%3D; Arrow Part Number: DMG3406L-13; Arrow Price/Stock: https://www.arrow.com/en/products/dmg3406l-13/diodes-incorporated?region=nac
R85 R86 = RNCL2512FT50R0: Resistor; Manufacturer_Name: Stackpole Electronics; Datasheet Link: https://www.seielect.com/catalog/sei-rncl.pdf; Height: 0.65mm; Manufacturer_Part_Number: RNCL2512FT50R0; Resistance: 50

## Sheet LCD.SchDoc
size A; SheetNumber: 5; SheetTotal: 5
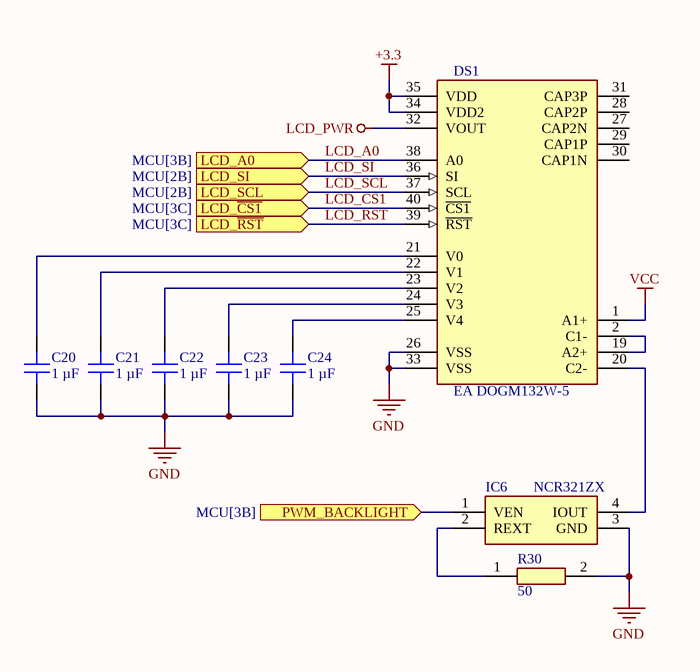
[diagram p10: LCD.SchDoc]

### Parts
(Parts that share a designator on the sheet are numbered #1, #2 ... from top to bottom, then left to right.)
C20  1 µF  [CAP 1206_3216 - 0.8MM]
C21  1 µF  [CAP 1206_3216 - 0.8MM]
C22#2  1 µF  [CAP 1206_3216 - 0.8MM]
C23#2  1 µF  [CAP 1206_3216 - 0.8MM]
C24#2  1 µF  [CAP 1206_3216 - 0.8MM]
DS1  EA DOGM132W-5  [FP-EA_DOGM132L-5-MFG]
IC6  NCR321ZX  [SOT230P700X180-4N]
R30#2  50  [RESC6332X65N]

### Ports
LCD_A0 (in, see MCU[3B]), LCD_SCL (in, see MCU[2B]), LCD_SI (in, see MCU[2B]), LCD_~{CS1} (in, see MCU[3C]), LCD_~{RST} (in, see MCU[3C]), PWM_BACKLIGHT (in, see MCU[3B])

### Nets
+3.3: DS1.34(VDD2) DS1.35(VDD)
GND: C20.1 C21.1 C22#2.1 C23#2.1 C24#2.1 DS1.26(VSS) DS1.33(VSS) IC6.3(GND) R30#2.2
LCD_PWR: DS1.32(VOUT)
VCC: DS1.1(A1+)
LCD~{_CS}1: DS1.40(~{CS1}) ; port LCD_~{CS1}
LCD~{_RS}T: DS1.39(~{RST}) ; port LCD_~{RST}
LCD_A0: DS1.38(A0) ; port LCD_A0
LCD_SCL: DS1.37(SCL) ; port LCD_SCL
LCD_SI: DS1.36(SI) ; port LCD_SI
NetC20_2: C20.2 DS1.21(V0)
NetC21_2: C21.2 DS1.22(V1)
NetC22#2_2: C22#2.2 DS1.23(V2)
NetC23#2_2: C23#2.2 DS1.24(V3)
NetC24#2_2: C24#2.2 DS1.25(V4)
NetDS1_2: DS1.2(C1-) DS1.19(A2+)
NetDS1_20: DS1.20(C2-) IC6.4(IOUT)
NetIC1_37: IC6.1(VEN) ; port PWM_BACKLIGHT
NetIC6_2: IC6.2(REXT) R30#2.1

Not connected (* = marked no-connect by the designer): DS1 27(CAP2N) 28(CAP2P) 29(CAP1P) 30(CAP1N) 31(CAP3P)

### Library data of the parts
C20 C21 C22#2 C23#2 C24#2 = 885012208093: CAP CER 1UF 50V X7R 1206; manufacturer: Würth Elektronik; Tolerance: ±10%; Part Number: 885012208093; Capacitance: 1 µF; Applications: General Purpose; componentlink1description: Datasheet; componentlink1url: https://katalog.we-online.de/pbs/datasheet/885012208093.pdf; componentlink2description: DigiKey Link; componentlink2url: https://www.digikey.com/en/products/detail/würth-elektronik/885012208093/5453432; Device Package: 1206 (3216 Metric); lastupdated: 6/4/2024 19:10:33; Lifecycle Status: Active; Minimum Order: 1; Mounting Type: Surface Mount, MLCC; Operating Temperature: -55°C ~ 125°C; Package / Case: 1206 (3216 Metric); packaging: TapeAndReel; partid: 39665; Part Status: Active; price: 0.10; series: WCAP-CSGP; Size / Dimension: 0.126" L x 0.063" W (3.20mm x 1.60mm); Supplier 1: DigiKey; Supplier Part Number 1: 732-7577-1-ND; Temperature Coefficient: X7R; Thickness (Max): 0.075" (1.90mm); value: 1 µF; Voltage - Rated: 50V
DS1 = CMP-137185-000001-1: LCD MOD GRAPH 132X32 Y/G; Supply Current: 140uA; Background Color: Green; Resolution (height): 32pixel; Fluid Type: STN POSITIVE; Interface: SPI; Viewing Area (width): 51mm; Resolution (width): 132pixel; Viewing Area (height): 15mm; RoHS Compliant: No; Height: 27.94mm; Min Operating Temperature: -20°C; Packaging: Bulk; Max Operating Temperature: 70°C; Nominal Supply Current: 140uA; Series: EA DOGM; Width: 55mm
IC6 = NCR321ZX: Integrated Circuit; Manufacturer_Name: Nexperia; Datasheet Link: https://componentsearchengine.com/Datasheets/2/NCR321ZX.pdf; Height: 1.8mm; Manufacturer_Part_Number: NCR321ZX; Mouser Part Number: 771-NCR321ZX; Mouser Price/Stock: https://www.mouser.co.uk/ProductDetail/Nexperia/NCR321ZX?qs=ahcBuItHZ3zTr8W8PrL%2FCg%3D%3D; Arrow Part Number: NCR321ZX; Arrow Price/Stock: https://www.arrow.com/en/products/ncr321zx/nexperia?region=nac
R30#2 = RNCL2512FT50R0: Resistor; Manufacturer_Name: Stackpole Electronics; Datasheet Link: https://www.seielect.com/catalog/sei-rncl.pdf; Height: 0.65mm; Manufacturer_Part_Number: RNCL2512FT50R0; Resistance: 50

## Sheet resistors.SchDoc
size 381 x 241 mm; SheetNumber: 12; SheetTotal: 12
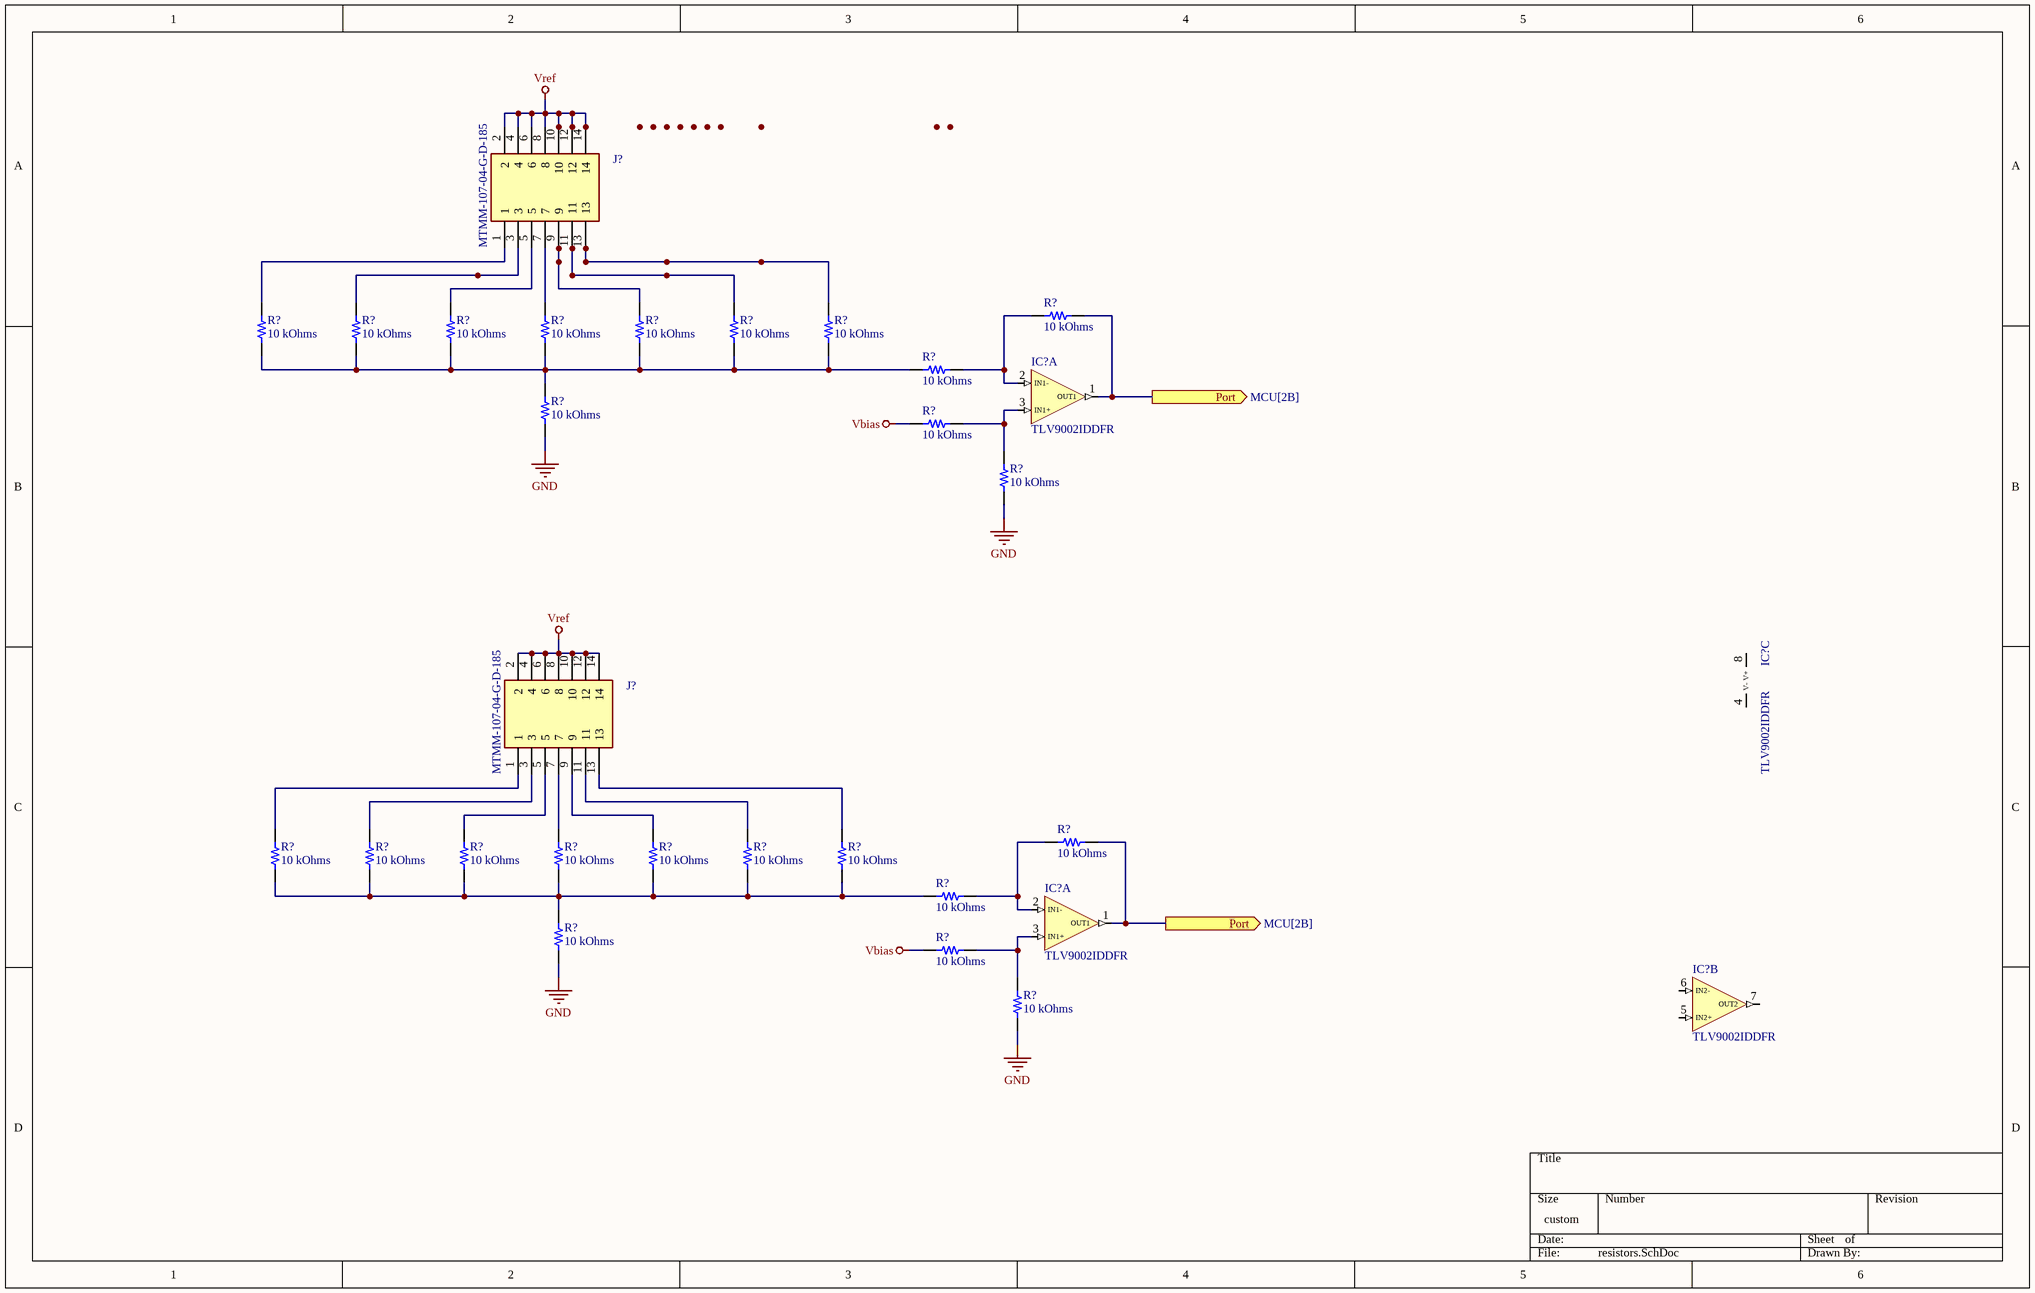
[diagram p11: resistors.SchDoc]

### Parts
(Parts that share a designator on the sheet are numbered #1, #2 ... from top to bottom, then left to right.)
IC?#1  TLV9002IDDFR  [SOT65P280X110-8N]  (part A of 3)
IC?#2  TLV9002IDDFR  [SOT65P280X110-8N]  (part C of 3)
IC?#3  TLV9002IDDFR  [SOT65P280X110-8N]  (part A of 3)
IC?#4  TLV9002IDDFR  [SOT65P280X110-8N]  (part B of 3)
J?#1  MTMM-107-04-G-D-185  [MTMM10704GD185]
J?#2  MTMM-107-04-G-D-185  [MTMM10704GD185]
R?#1  10 kOhms  [YAGEO RES 1206_3216]
R?#2  10 kOhms  [YAGEO RES 1206_3216]
R?#3  10 kOhms  [YAGEO RES 1206_3216]
R?#4  10 kOhms  [YAGEO RES 1206_3216]
R?#5  10 kOhms  [YAGEO RES 1206_3216]
R?#6  10 kOhms  [YAGEO RES 1206_3216]
R?#7  10 kOhms  [YAGEO RES 1206_3216]
R?#8  10 kOhms  [YAGEO RES 1206_3216]
R?#9  10 kOhms  [YAGEO RES 1206_3216]
R?#10  10 kOhms  [YAGEO RES 1206_3216]
R?#11  10 kOhms  [YAGEO RES 1206_3216]
R?#12  10 kOhms  [YAGEO RES 1206_3216]
R?#13  10 kOhms  [YAGEO RES 1206_3216]
R?#14  10 kOhms  [YAGEO RES 1206_3216]
R?#15  10 kOhms  [YAGEO RES 1206_3216]
R?#16  10 kOhms  [YAGEO RES 1206_3216]
R?#17  10 kOhms  [YAGEO RES 1206_3216]
R?#18  10 kOhms  [YAGEO RES 1206_3216]
R?#19  10 kOhms  [YAGEO RES 1206_3216]
R?#20  10 kOhms  [YAGEO RES 1206_3216]
R?#21  10 kOhms  [YAGEO RES 1206_3216]
R?#22  10 kOhms  [YAGEO RES 1206_3216]
R?#23  10 kOhms  [YAGEO RES 1206_3216]
R?#24  10 kOhms  [YAGEO RES 1206_3216]

### Ports
Port (out, see MCU[2B])

### Nets
GND: R?#10.1 R?#12.1 R?#22.1 R?#24.1
Vbias: R?#11.2 R?#23.2
Vref: J?#1.2 J?#1.4 J?#1.6 J?#1.8 J?#1.10 J?#1.12 J?#1.14 J?#2.2 J?#2.4 J?#2.6 J?#2.8 J?#2.10 J?#2.12 J?#2.14
NetIC?#1_1: IC?#1.1(OUT1) IC?#3.1(OUT1) R?#1.1 R?#13.1 ; port Port
NetIC?#1_2: IC?#1.2(IN1-) R?#1.2 R?#9.1
NetIC?#1_3: IC?#1.3(IN1+) R?#11.1 R?#12.2
NetIC?#3_2: IC?#3.2(IN1-) R?#13.2 R?#21.1
NetIC?#3_3: IC?#3.3(IN1+) R?#23.1 R?#24.2
NetJ?#1_1: J?#1.1 R?#2.2
NetJ?#1_3: J?#1.3 R?#3.2
NetJ?#1_5: J?#1.5 R?#4.2
NetJ?#1_7: J?#1.7 R?#5.2
NetJ?#1_9: J?#1.9 R?#6.2
NetJ?#1_11: J?#1.11 R?#7.2
NetJ?#1_13: J?#1.13 R?#8.2
NetJ?#2_1: J?#2.1 R?#14.2
NetJ?#2_3: J?#2.3 R?#15.2
NetJ?#2_5: J?#2.5 R?#16.2
NetJ?#2_7: J?#2.7 R?#17.2
NetJ?#2_9: J?#2.9 R?#18.2
NetJ?#2_11: J?#2.11 R?#19.2
NetJ?#2_13: J?#2.13 R?#20.2
NetR?#2_1: R?#2.1 R?#3.1 R?#4.1 R?#5.1 R?#6.1 R?#7.1 R?#8.1 R?#9.2 R?#10.2
NetR?#14_1: R?#14.1 R?#15.1 R?#16.1 R?#17.1 R?#18.1 R?#19.1 R?#20.1 R?#21.2 R?#22.2

Not connected (* = marked no-connect by the designer): IC?#2 4(V-) 8(V+); IC?#4 5(IN2+) 6(IN2-) 7(OUT2)

### Library data of the parts
IC?#1-IC?#4 = TLV9002IDDFR: Integrated Circuit; Manufacturer_Name: Texas Instruments; Datasheet Link: https://www.ti.com/lit/gpn/TLV9002; Height: 1.1mm; Manufacturer_Part_Number: TLV9002IDDFR; Mouser Part Number: 595-TLV9002IDDFR; Mouser Price/Stock: https://www.mouser.co.uk/ProductDetail/Texas-Instruments/TLV9002IDDFR?qs=mAH9sUMRCtuVJ6NmNV%252Bgrw%3D%3D; Arrow Part Number: TLV9002IDDFR; Arrow Price/Stock: https://www.arrow.com/en/products/tlv9002iddfr/texas-instruments?utm_currency=USD&region=nac
J?#1 J?#2 = MTMM-107-04-G-D-185: Connector; Manufacturer_Name: SAMTEC; Datasheet Link: https://suddendocs.samtec.com/prints/mtmm-1xx-xx-xx-x-xxx-xx-xxx-mkt.pdf?_gl=1*gklr36*_gcl_aw*R0NMLjE3NDEzMjczNDIuQ2p3S0NBaUFyS1ctQmhBekVpd0FaaFdzSU81NXRXcmh5VS16b3pEZ1BfdFZablZIZUl1bFk4SG5uQlVzb0JsazkxbHVlaFo1OVhKaGZCb0N5SGtRQXZEX0J3RQ..*_gcl_au*OTA0NjU5; Height: 8.333mm; Manufacturer_Part_Number: MTMM-107-04-G-D-185; Mouser Part Number: 200-MTMM10704GD185; Mouser Price/Stock: https://www.mouser.co.uk/ProductDetail/Samtec/MTMM-107-04-G-D-185?qs=DJA8%252BIqD56WvW%2Fj12n4w4g%3D%3D
R?#1-R?#24 = RT1206FRE0710KL: RES SMD 10K OHM 1% 1/4W 1206; Manufacturer: Yageo; Power (Watts): 0.25W, 1/4W; Temperature Coefficient: ±50ppm/°C; Part Number: RT1206FRE0710KL; ComponentLink1Description: Datasheet; ComponentLink1URL: https://www.yageo.com/upload/media/product/productsearch/datasheet/rchip/PYu-RT_1-to-0.01_RoHS_L_11.pdf; ComponentLink2Description: DigiKey Link; ComponentLink2URL: https://www.digikey.com/en/products/detail/yageo/RT1206FRE0710KL/1082868; Composition: Thin Film; Device Package: 1206 (3216 Metric); Height - Seated (Max): 0.026" (0.65mm); LastUpdated: 7/25/2024 09:21:28; Lifecycle Status: Active; Minimum Order: 1; Number of Terminations: 2; Operating Temperature: -55°C ~ 155°C; Package / Case: 1206 (3216 Metric); Packaging: TapeAndReel; PartId: 38903; Part Status: Active; Price: 0.01; Resistance: 10 kOhms; Series: RT; Size / Dimension: 0.122" L x 0.063" W (3.10mm x 1.60mm); Supplier 1: DigiKey; Supplier Part Number 1: YAG1242CT-ND; Supplier Device Package: 1206; Tolerance: ±1%; Value: 10 kOhms

## Nets that join several sheets
+3.3: power (11 pins), MCU (IC1.4 IC1.6), misc (5 pins), LCD (DS1.34 DS1.35)
GND: source_A (6 pins), source_B (6 pins), vca_A (C54#1.1 R22#1.2 R36#1.1), vca_B (C111.1 R108.2 R122.1), filters (18 pins), power (39 pins), MCU (8 pins), LDO (14 pins), misc (38 pins), connectors (32 pins), LCD (9 pins), resistors (R?#10.1 R?#12.1 R?#22.1 R?#24.1)
LCD_PWR: power (5 pins), LCD (DS1.32)
VCC: source_A (Q1#1.3 Q2#1.7_8 R1#1.2 R2#1.2), source_B (Q13.3 Q14.7_8 R87.2 R88.2), power (10 pins), LDO (5 pins), connectors (6 pins), LCD (DS1.1)
VCC_direct: power (J5#2.1 Q1#2.3 R44#2.1), misc (D2#2.1)
VCC_LDO_OUT: vca_A (5 pins), vca_B (5 pins), LDO (6 pins)
VDD: source_A (Q2#1.5_6 Q4.3 R9#1.1 R10#1.1), source_B (Q14.5_6 Q16.3 R95.1 R96.1), LDO (5 pins), connectors (6 pins)
VDD_LDO_OUT: vca_A (5 pins), vca_B (5 pins), LDO (6 pins)
Vref: vca_A (R29#1.2), vca_B (R115.2), filters (6 pins), power (16 pins), MCU (IC1.5), misc (5 pins), resistors (14 pins)
LCD~{_CS}1: MCU (IC1.28), LCD (DS1.40)
LCD~{_RS}T: MCU (IC1.27), LCD (DS1.39)
LCD_A0: MCU (IC1.29), LCD (DS1.38)
LCD_SCL: MCU (IC1.42), LCD (DS1.37)
LCD_SI: MCU (IC1.44), LCD (DS1.36)
LDO_EN: power (U2#2.5), MCU (IC1.34), LDO (U4.5 U6.3)
NetC1#2_2: MCU (C1#2.2 IC1.10 S1.3 S1.4), misc (J3#2.10)
NetC2#2_2: MCU (IC1.30), misc (C2#2.2 J2#1.1 R5#2.2)
NetC3_2: MCU (IC1.31), misc (C3.2 J1#1.1 R4#2.2)
NetC6_1: MCU (IC1.8), misc (C6.1 Y1.1)
NetC7#2_2: MCU (IC1.9), misc (C7#2.2 Y1.3)
NetC8#1_1: filters (C8#1.1 IC3.6 IC3.7), MCU (IC1.17)
NetC10_1: filters (C10.1 IC3.1 IC3.2), MCU (IC1.16)
NetC12_1: filters (C12.1 IC4.1 IC4.2), MCU (IC1.22)
NetC14_1: filters (C14.1 IC5.1 IC5.2), MCU (IC1.19)
NetC16_1: filters (C16.1 IC4.6 IC4.7), MCU (IC1.23)
NetC18_1: filters (C18.1 IC5.6 IC5.7), MCU (IC1.20)
NetC44_2: MCU (IC1.38), misc (C44.2 S2.3 S2.4)
NetC45_2: MCU (IC1.39), misc (C45.2 S3.3 S3.4)
NetC46#2_2: MCU (IC1.41), misc (C46#2.2 S4.3 S4.4)
NetC47#2_2: MCU (IC1.40), misc (C47#2.2 S5.3 S5.4)
NetC48_2: MCU (IC1.33), misc (C48.2 SW1.2)
NetD3#1_2: filters (D3#1.2 R7#2.1), connectors (J96.3)
NetD4#1_2: filters (D4#1.2 R11#2.1), connectors (J95.3)
NetD5#1_2: source_B (5 pins), filters (D5#1.2 R15#2.1)
NetD6#2_2: source_A (5 pins), filters (D6#2.2 R19#2.1)
NetD7#1_2: filters (D7#1.2 R23#2.1), connectors (D8#2.2 J93.1 J94.1)
NetD7#2_2: filters (D8#1.2 R27#2.1), connectors (D7#2.2 J90.1 J91.1)
NetD9_2: source_A (J9.1 R5#1.1 R63.1), connectors (D9.2 J1#2.1)
NetD10_2: source_B (J57.1 R91.1 R150.1), connectors (D10.2 J2#2.1)
NetIC1_1: MCU (IC1.1), misc (LS1.1)
NetIC1_11: MCU (IC1.11), misc (IC10.1)
NetIC1_12: MCU (IC1.12), misc (IC10.2)
NetIC1_13: MCU (IC1.13), misc (IC2.4)
NetIC1_14: MCU (IC1.14), misc (IC2.5)
NetIC1_25: MCU (IC1.25), misc (IC2.2)
NetIC1_26: MCU (IC1.26), misc (IC2.3)
NetIC1_35: MCU (IC1.35), misc (J3#2.2)
NetIC1_36: MCU (IC1.36), misc (J3#2.4)
NetIC1_37: MCU (IC1.37), LCD (IC6.1)
NetIC1_45: MCU (IC1.45), misc (Q2#2.1 R42#2.2)
NetIC1_46: MCU (IC1.46), misc (Q2#2.2 R43#2.2)
NetJ14_1: source_A (J14.1), vca_A (R21#1.1 U3.1)
NetJ20_1: source_B (J20.1), vca_B (R107.1 U15.1)
NetJ95_1: source_A (R61.2), connectors (J95.1)
NetJ96_1: source_B (R148.2), connectors (J96.1)
NetR1#2_1: vca_A (R28#1.1), misc (R1#2.1)
NetR27#1_1: vca_A (R27#1.1), misc (R35#2.1)
NetR36#2_1: vca_B (R114.1), misc (R36#2.1)
NetR37#2_1: vca_B (R113.1), misc (R37#2.1)